# EAGLE design piSchoolBell-12pinLCD (EAGLE 9.5.2)
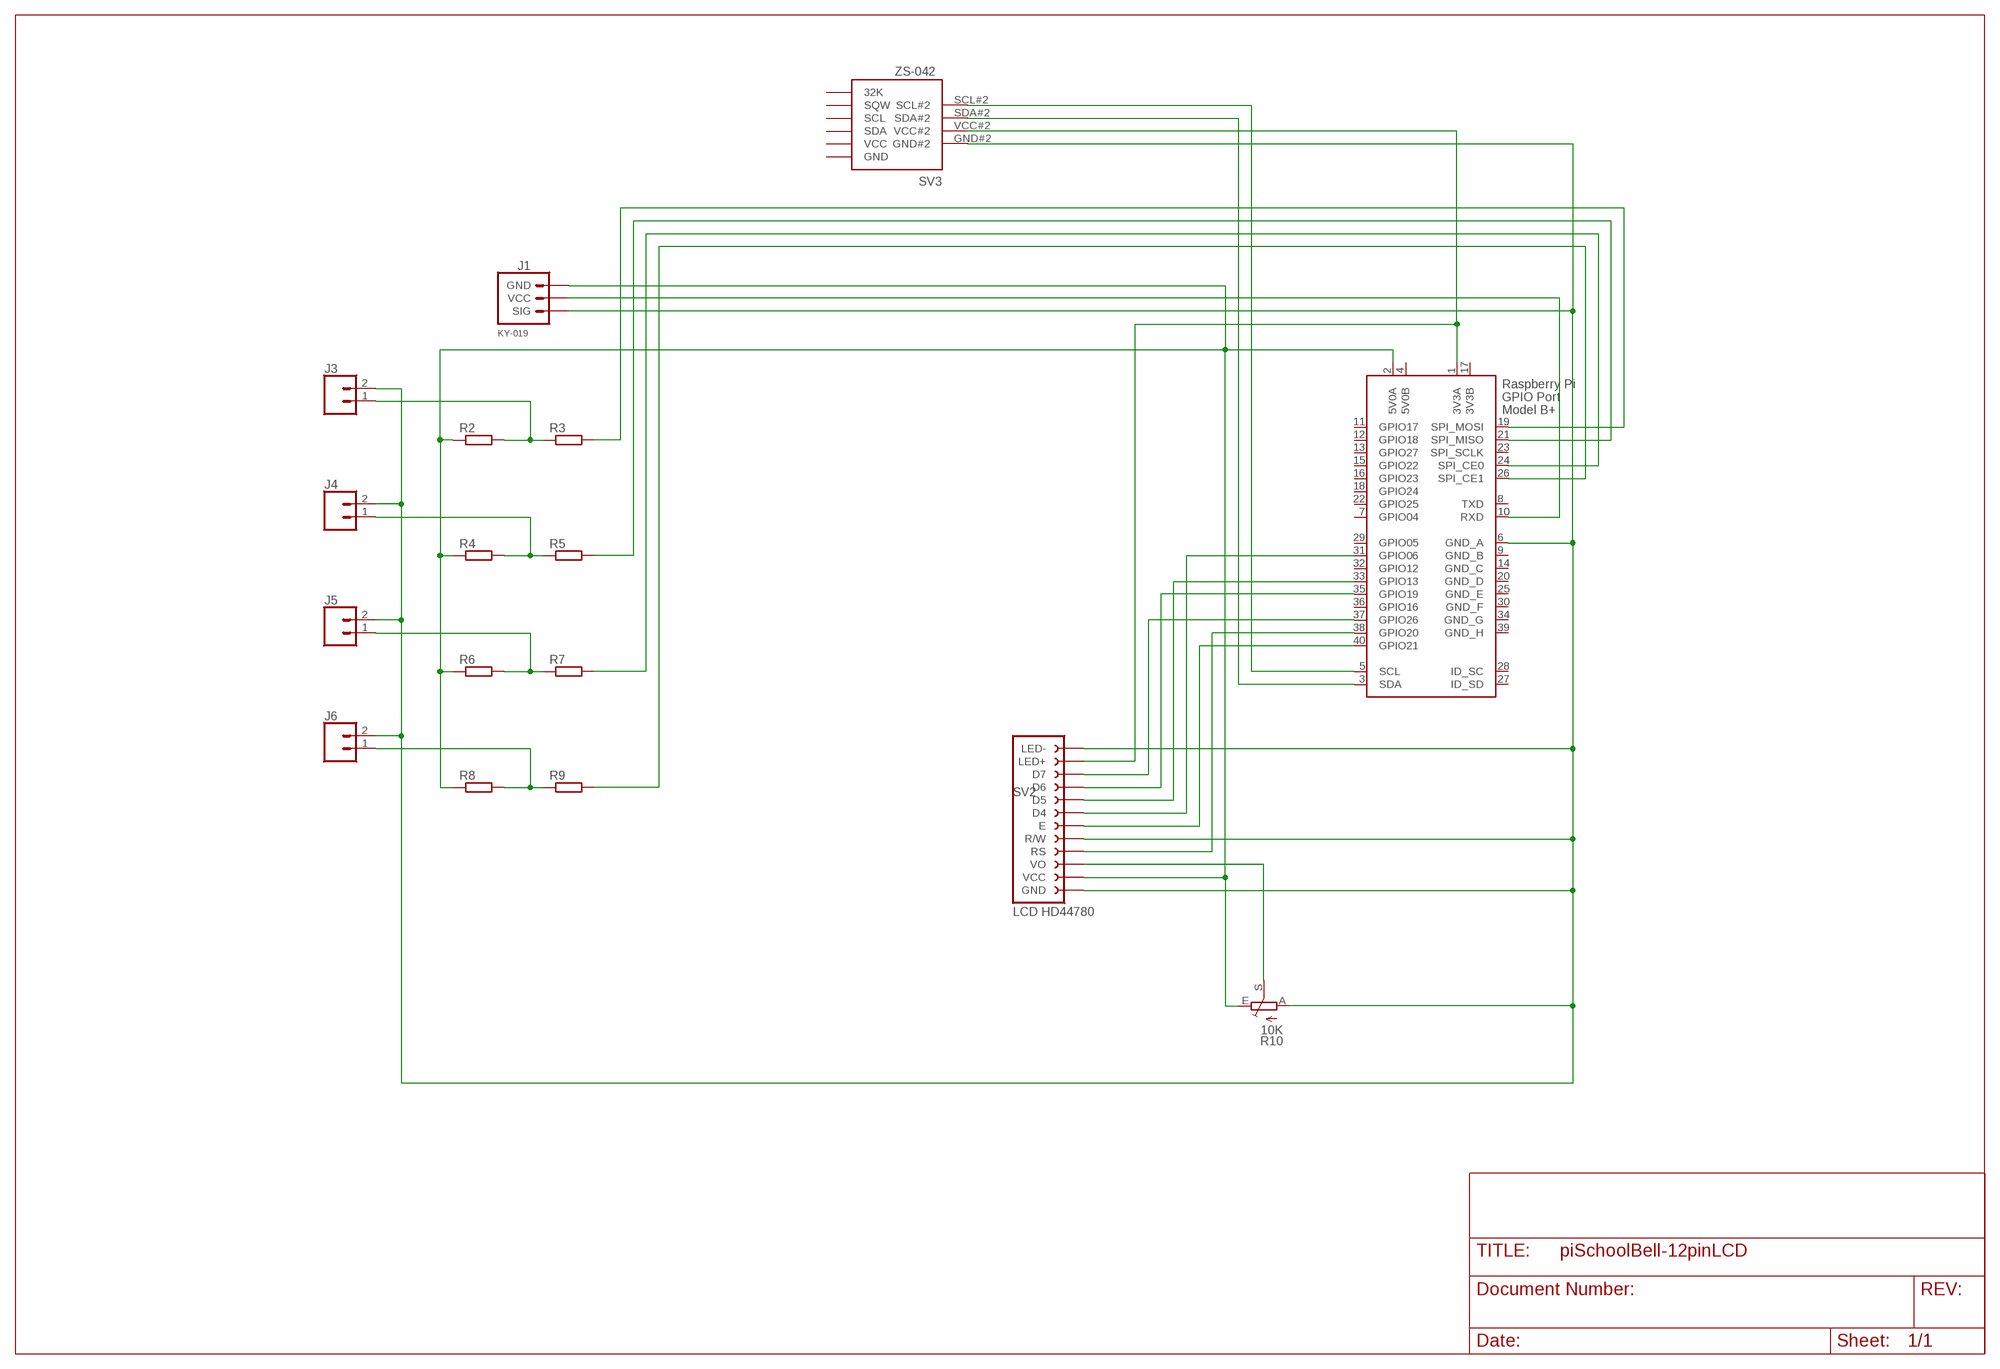
[diagram p0: schematic, sheet 1]

## Parts
J1  455-1750-1-ND  KY-019_3-PIN_MALE_HEADER  [KY-019_3-PIN_MALE_HEADER]
J3  CONN_02  [1X02]
J4  CONN_02  [1X02]
J5  CONN_02  [1X02]
J6  CONN_02  [1X02]
R2  R-EU_0204/7  [0204/7]
R3  R-EU_0204/7  [0204/7]
R4  R-EU_0204/7  [0204/7]
R5  R-EU_0204/7  [0204/7]
R6  R-EU_0204/7  [0204/7]
R7  R-EU_0204/7  [0204/7]
R8  R-EU_0204/7  [0204/7]
R9  R-EU_0204/7  [0204/7]
R10  10K  TRIM_EU-B25P  [B25P]
SV2  LCD-HD44780-12-PIN_FEMALE_HEADER  [LCD-HD44780-12-PIN_FEMALE_HEADER]
SV3  ZS-042_RTC_6+4-PIN_FEMALE_HEADER  [ZS-042_RTC_6+4-PIN_FEMALE_HEADER_W_MOUNT_HOLES]
X1  RASPI_BOARD_B+#_H  [RASPI_BOARD_B+HAT]

## Nets
GND: J1.SIG J3.2 J4.2 J5.2 J6.2 R10.A SV2.GND SV2.LED- SV2.R/W SV3.GND#2 X1.6(GND_A)
N$1: R10.S SV2.VO
N$3: SV3.SDA#2 X1.3(SDA)
N$4: SV3.SCL#2 X1.5(SCL)
N$6: J3.1 R2.2 R3.1
N$7: R3.2 X1.19(SPI_MOSI)
N$9: SV2.RS X1.38(GPIO20)
N$11: SV2.E X1.40(GPIO21)
N$12: SV2.D4 X1.31(GPIO06)
N$13: SV2.D5 X1.33(GPIO13)
N$14: SV2.D6 X1.35(GPIO19)
N$15: J1.GND R2.1 R4.1 R6.1 R8.1 R10.E SV2.VCC X1.2(5V0A)
N$16: SV2.D7 X1.37(GPIO26)
N$18: SV2.LED+ SV3.VCC#2 X1.1(3V3A)
N$19: J4.1 R4.2 R5.1
N$20: J5.1 R6.2 R7.1
N$21: J6.1 R8.2 R9.1
N$23: R5.2 X1.21(SPI_MISO)
N$24: R7.2 X1.24(SPI_CE0)
N$25: R9.2 X1.26(SPI_CE1)
N$28: J1.VCC X1.10(RXD)
Unconnected: SV3.32K SV3.GND SV3.SCL SV3.SDA SV3.SQW SV3.VCC X1.7(GPIO04) X1.8(TXD) X1.11(GPIO17) X1.12(GPIO18) X1.13(GPIO27) X1.15(GPIO22) X1.16(GPIO23) X1.18(GPIO24) X1.22(GPIO25) X1.23(SPI_SCLK) X1.27(ID_SD) X1.28(ID_SC) X1.29(GPIO05) X1.32(GPIO12) X1.36(GPIO16)

## Power pins joined to a net without a drawn wire
3V3B: X1.17(3V3B)
5V0B: X1.4(5V0B)
GND_B: X1.9(GND_B)
GND_C: X1.14(GND_C)
GND_D: X1.20(GND_D)
GND_E: X1.25(GND_E)
GND_F: X1.30(GND_F)
GND_G: X1.34(GND_G)
GND_H: X1.39(GND_H)

## Library data of the parts
J1 = myLib-01-Headers:KY-019_3-PIN_MALE_HEADER: Header for the 3 pin KY-019 arduino relay module Male; PROD_ID: XXX-00000
J3-J6 = SparkFun-Connectors:CONN_02: Multi connection point. Often used as Generic Header-pin footprint for 0.1 inch spaced/style header connections On any of the 0.1 inch spaced packages, you can populate with these: Break Away Headers - Straight <https://www.sparkfun.com/products/116> (PRT-00116) Break Away Male Headers - Right Angle <https://www.sparkfun.com/products/553> (PRT-00553) Female Headers <https://www.sparkfun.com/products/115> (PRT-00115) Break Away Headers - Machine Pin <https://www.sparkfun.com/products/117> (PRT-00117) Break Away Female Headers - Swiss Machine Pin <https://www.sparkfun.com/products/743> (PRT-00743) For SCREWTERMINALS and SPRING TERMINALS visit here: Screw Terimnals on SparkFun.com <https://www.sparkfun.com/search/results?term=Screw+Terminals> (5mm/3.5mm/2.54mm spacing) This device is also useful as a general connection point to wire up your design to another part of your project. Our various solder wires solder well into these plated through hole pads. Hook-Up Wire - Assortment (Stranded, 22 AWG) <https://www.sparkfun.com/products/11375> (PRT-11375) Hook-Up Wire - Assortment (Solid Core, 22 AWG) <https://www.sparkfun.com/products/11367> (PRT-11367) View the entire wire category on our website here <https://www.sparkfun.com/categories/141> Special notes: Molex polarized connector foot print use with: PRT-08233 with associated crimp pins and housings. 2.54_SCREWTERM for use with PRT-10571. 3.5mm Screw Terminal footprints for PRT-08084 5mm Screw Terminal footprints for use with PRT-08432
R2-R9 = rcl:R-EU_: RESISTOR, European symbol; SPICEPREFIX: R
R10 = pot:TRIM_EU-: POTENTIOMETER
SV2 = myLib-01-Headers:LCD-HD44780-12-PIN_FEMALE_HEADER: Header for the 16 pin HD44780 LCD module Female 12-pin used
SV3 = myLib-01-Headers:ZS-042_RTC_6+4-PIN_FEMALE_HEADER: Header for the ZS-042 RTC six+four pin module. Based on DS3231 Male Board measures 38x22 mm
X1 = raspberrypi_bastelstube_v13:RASPI_BOARD_B+#: Raspberry Pi GPIO connector with markings for the outer dimensions of the Raspberry Pi board model B+ with different sets of drill holes or mounting pads All pins connected

## Net classes
0 default: width 0.406 mm, clearance 0.152 mm

## Board
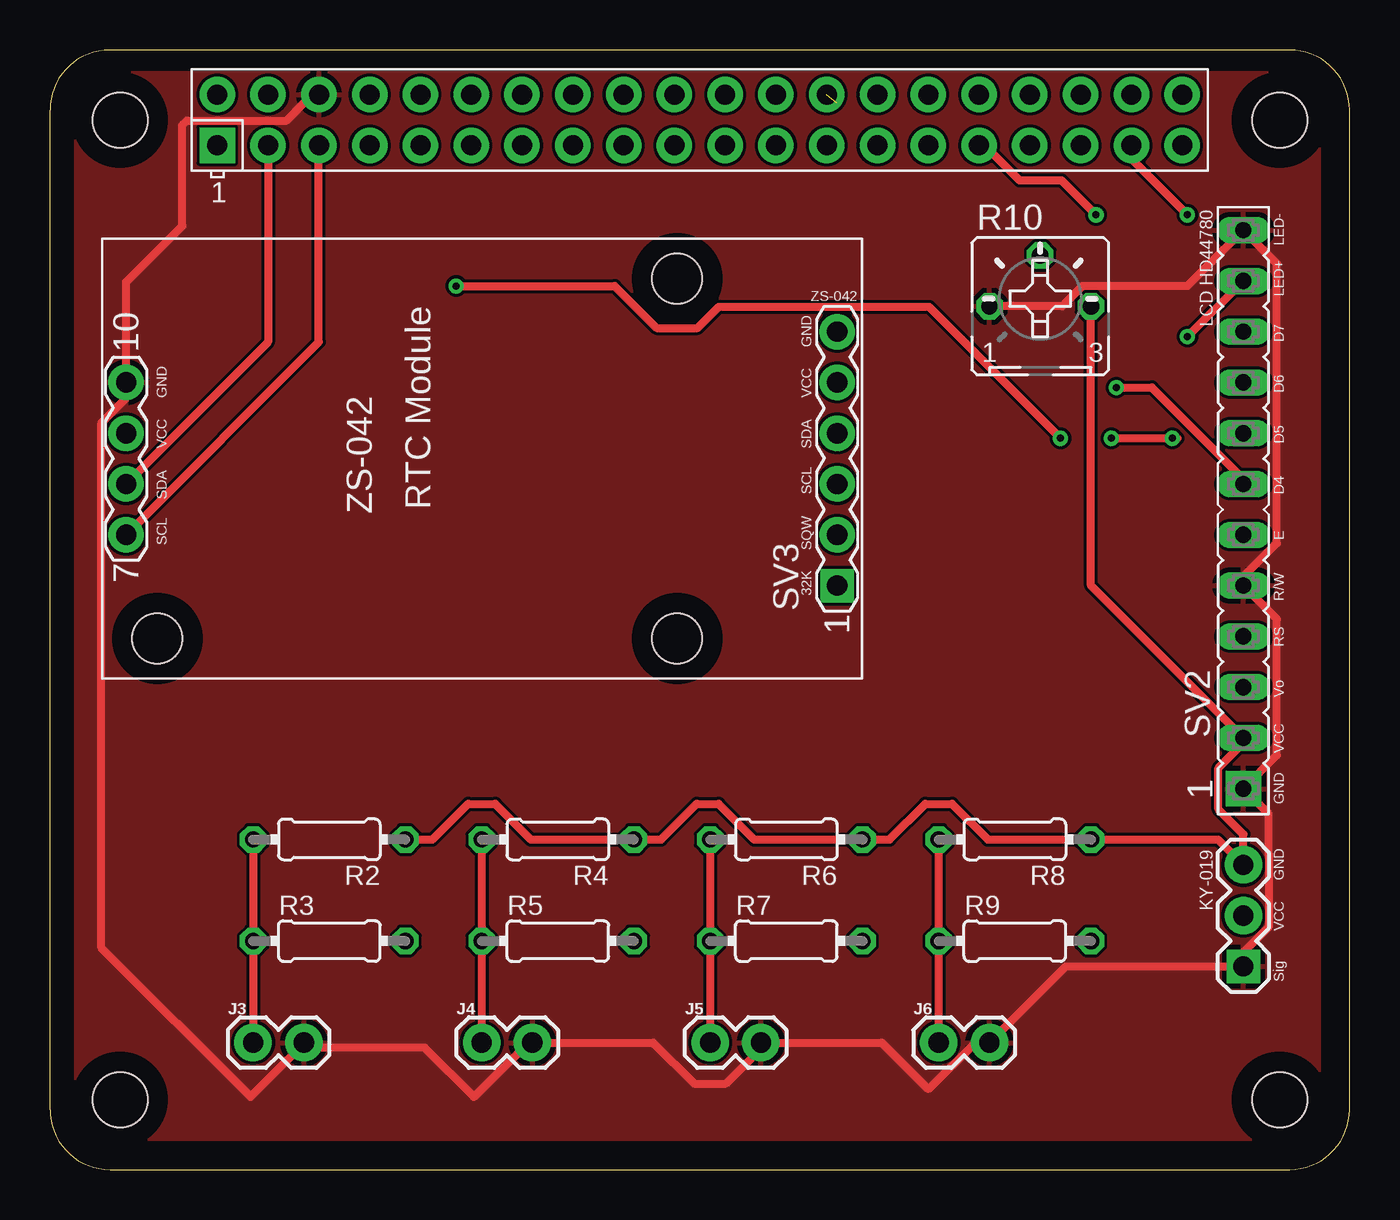
[diagram p1: board, top side]
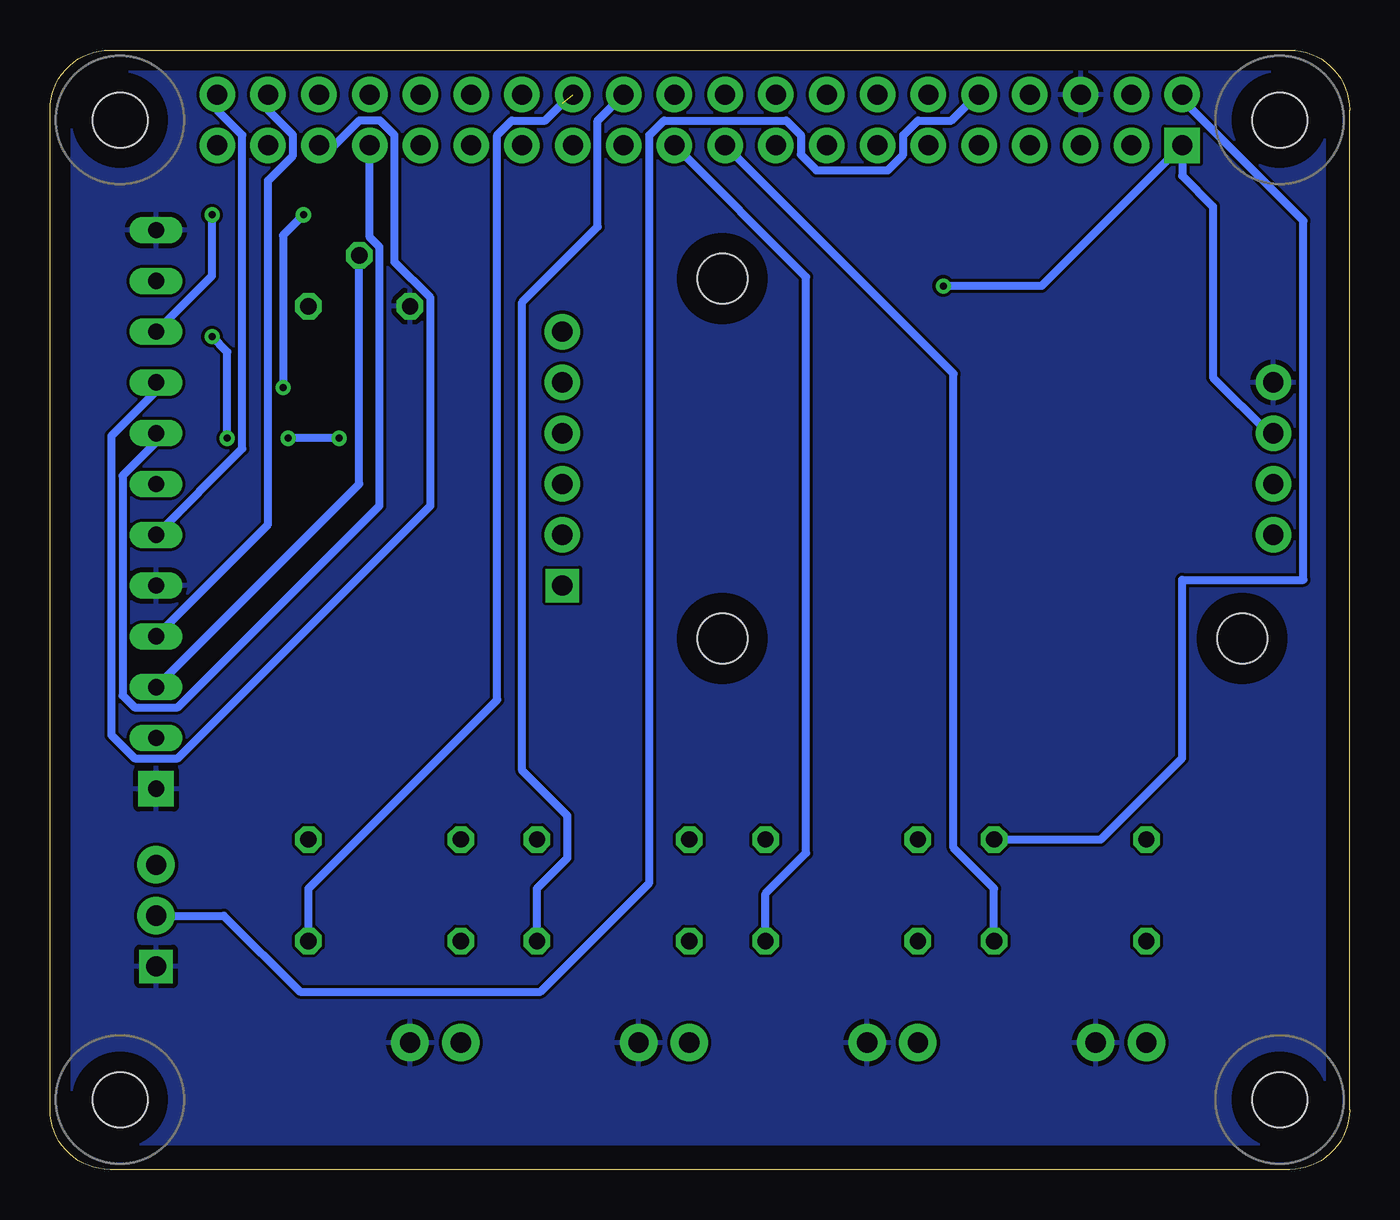
[diagram p2: board, bottom side, seen from below]

Size 65 x 56 mm. Coordinates in mm from the lower left corner, seen from the top.
Copper layers (1*16): Top 0.035mm / dielectric 1.5mm / Bottom 0.035mm
Design rules "default": minimum track width 6mil, minimum drill 0.35mm, track to track 6mil, track to pad 6mil, pad to pad 6mil, via to via 6mil, smd to smd 6mil, copper to edge 40mil, drill to drill 6mil, minimum pad ring 10mil, minimum via ring 8mil, stop-mask expansion 4mil, vias tented up to drill 0mil, thermal gap 10mil

### Footprints (pad centres in the part's own frame; a part is rotated, then mirrored left to right if it is on the bottom)
KY-019_3-PIN_MALE_HEADER = drill 1.016 pad 1.88: GND 5.08,0; VCC 2.54,0 | drill 1.016 pad 1.676 square: SIG 0,0
1X02 = drill 1.016 pad 1.88: 1 0,0; 2 2.54,0
0204/7 = drill 0.813 octagon: 1 -3.81,0; 2 3.81,0
B25P = drill 0.813 octagon: A -2.54,0; E 2.54,0; S 0,2.54
LCD-HD44780-12-PIN_FEMALE_HEADER = drill 0.813 long: D4 15.24,0; D5 17.78,0; D6 20.32,0; D7 22.86,0; E 12.7,0; LED+ 25.4,0; LED- 27.94,0; R/W 10.16,0; RS 7.62,0; VCC 2.54,0; VO 5.08,0 | drill 0.813 pad 1.778 square: GND 0,0
ZS-042_RTC_6+4-PIN_FEMALE_HEADER_W_MOUNT_HOLES = drill 1.016 pad 1.676 square: 32K 0,0 | drill 1.016 pad 1.778: GND 12.7,0; GND#2 10.16,35.56; SCL 5.08,0; SCL#2 2.54,35.56; SDA 7.62,0; SDA#2 5.08,35.56; SQW 2.54,0; VCC 10.16,0; VCC#2 7.62,35.56 | hole 2.5: -2.65,8; 15.35,8; -2.65,34
RASPI_BOARD_B+HAT = drill 1 pad 1.778 square: 1 8.37,51.23 | drill 1 pad 1.778: 2 8.37,53.77; 3 10.91,51.23; 4 10.91,53.77; 5 13.45,51.23; 6 13.45,53.77; 7 15.99,51.23; 8 15.99,53.77; 9 18.53,51.23; 10 18.53,53.77; 11 21.07,51.23; 12 21.07,53.77; 13 23.61,51.23; 14 23.61,53.77; 15 26.15,51.23; 16 26.15,53.77; 17 28.69,51.23; 18 28.69,53.77; 19 31.23,51.23; 20 31.23,53.77; 21 33.77,51.23; 22 33.77,53.77; 23 36.31,51.23; 24 36.31,53.77; 25 38.85,51.23; 26 38.85,53.77; 27 41.39,51.23; 28 41.39,53.77; 29 43.93,51.23; 30 43.93,53.77; 31 46.47,51.23; 32 46.47,53.77; 33 49.01,51.23; 34 49.01,53.77; 35 51.55,51.23; 36 51.55,53.77; 37 54.09,51.23; 38 54.09,53.77; 39 56.63,51.23; 40 56.63,53.77 | hole 2.75: 3.5,3.5; 3.5,52.5; 61.5,3.5; 61.5,52.5

### Placement (x,y rotation side)
J1  59.69,10.16 90 top
J3  10.16,6.35 0 top
J4  21.59,6.35 0 top
J5  33.02,6.35 0 top
J6  44.45,6.35 0 top
R2  13.97,16.51 180 top
R3  13.97,11.43 0 top
R4  25.4,16.51 180 top
R5  25.4,11.43 0 top
R6  36.83,16.51 180 top
R7  36.83,11.43 0 top
R8  48.26,16.51 180 top
R9  48.26,11.43 0 top
R10  49.53,43.18 0 top
SV2  59.69,19.05 90 top
SV3  39.37,29.21 90 top
X1  0,0 0 top

### Tracks (layer width: path | path; a pad name or v marks a point on that pad's centre or on a via)
GND
  Top 0.406: R10.A 50.63,43.18 51.65,44.2 56.9,44.2 SV2.LED- 61.37,45.31 61.37,31.33 59.69,29.65 SV2.R/W 61.37,27.53 61.37,20.73 SV2.GND 60.96,17.78 60.96,15.8 60.98,15.78 60.98,12.16 59.69,10.87 J1.SIG 50.8,10.16 J6.2 46.28,6.35 43.97,4.04 43.91,4.04 41.6,6.35 J5.2 35.56,6.04 33.81,4.29 32.23,4.29 30.17,6.35 J4.2 23.93,6.35 21.21,3.63 18.74,6.1 12.95,6.1 J3.2 12.7,6.3 10.03,3.63 2.56,11.1 2.56,37.35 3.81,38.59 SV3.GND#2 3.81,44.39 6.62,47.2 6.62,52.25 6.84,52.47 11.83,52.47 12.7,53.34
  pour Top: 1.27,54.61 1.27,1.78 1.52,1.52 63.25,1.52 63.5,1.78 63.5,54.36 62.99,54.86 1.52,54.86
  pour Bottom: 1.27,54.86 1.27,1.27 64.01,1.27 64.01,54.36 63.25,55.12 1.52,55.12
N$1
  Bottom 0.406: SV2.VO 49.53,34.29 R10.S
N$3
  Top 0.406: X1.3 10.91,41.39 SV3.SDA#2
N$4
  Top 0.406: SV3.SCL#2 13.45,41.39 X1.5
N$6
  Top 0.406: R2.2 R3.1 J3.1
N$7
  Bottom 0.406: R3.2 17.78,14.06 19.81,16.09 19.81,39.81 X1.19
N$9
  Bottom 0.406: SV2.RS 54.09,32.27 54.09,49.47 52.84,50.71 52.84,51.75 54.09,52.99 X1.38
N$11
  Bottom 0.406: X1.40 56.63,52.99 55.38,51.75 55.38,36.05 SV2.E
N$12  (via drill 0.35)
  Top 0.406: X1.31 46.74,51.23 48.49,49.48 50.6,49.48 v52.32,47.75 | v53.34,39.12 55.12,39.12 59.69,34.54 SV2.D4
  Bottom 0.406: v52.32,47.75 53.34,46.74 v53.34,39.12
N$13
  Bottom 0.406: X1.33 49.01,46.64 48.51,46.14 48.51,33.21 58.61,23.11 60.77,23.11 61.37,23.71 61.37,34.71 59.69,36.39 SV2.D5
N$14
  Bottom 0.406: SV2.D6 59.69,38.93 61.92,36.69 61.92,21.73 60.77,20.57 58.61,20.57 45.97,33.21 45.97,43.6 47.76,45.39 47.76,51.75 48.49,52.47 49.53,52.47 50.77,51.23 X1.35
N$15
  Top 0.406: R2.1 19.14,16.51 20.91,18.29 22.26,18.29 24.04,16.51 R4.1 30.57,16.51 32.34,18.29 33.44,18.29 35.22,16.51 R6.1 42,16.51 43.77,18.29 45.12,18.29 46.9,16.51 R8.1 58.42,16.51 J1.GND 59.69,16.77 58.44,18.01 58.44,20.09 59.69,21.33 SV2.VCC 52.07,29.21 R10.E
  Bottom 0.406: R2.1 12.45,16.51 8.37,20.59 8.37,29.49 2.31,29.49 2.31,47.45 8.37,53.51 X1.2
N$16  (via drill 0.35)
  Top 0.406: v56.9,47.75 54.09,50.56 X1.37
  Bottom 0.406: SV2.D7 56.9,44.7 v56.9,47.75
N$18  (via drill 0.35)
  Top 0.406: v20.32,44.2 28.24,44.2 30.35,42.09 32.39,42.09 33.46,43.15 43.97,43.15 v50.55,36.58 | v53.09,36.58 v56.13,36.58 56.39,36.58 | v56.9,41.66 SV2.LED+
  Bottom 0.406: SV3.VCC#2 4.05,36.83 6.83,39.62 6.83,48.17 8.37,49.71 X1.1 15.4,44.2 v20.32,44.2 | v50.55,36.58 v53.09,36.58 | v56.13,36.58 56.13,40.89 v56.9,41.66
N$19
  Top 0.406: R4.2 R5.1 J4.1
N$20
  Top 0.406: R6.2 R7.1 J5.1
N$21
  Top 0.406: R8.2 R9.1 J6.1
N$23
  Bottom 0.406: R5.2 29.21,13.8 27.18,15.84 27.18,44.64 X1.21
N$24
  Bottom 0.406: R7.2 40.64,14.06 39.12,15.58 39.12,17.69 41.38,19.95 41.38,43.39 37.6,47.16 37.6,52.47 X1.24
N$25  (1 unrouted)
  Bottom 0.406: R9.2 52.07,14.06 42.63,23.49 42.63,51.75 41.91,52.47 40.23,52.47 39.37,53.34
N$28
  Bottom 0.406: X1.10 18.62,53.77 19.91,52.47 21.59,52.47 22.31,51.75 22.31,50.76 23.09,49.98 26.67,49.98 27.44,50.76 27.44,51.75 28.17,52.47 34.29,52.47 35.01,51.75 35.01,14.35 40.47,8.89 52.49,8.89 56.3,12.7 J1.VCC

### Text on the board
tDocu: Design: Jon Sagebrand / jonsagebrand@gmail.com / piSchoolBell @ https://github.com/jonsag/piSchoolBell